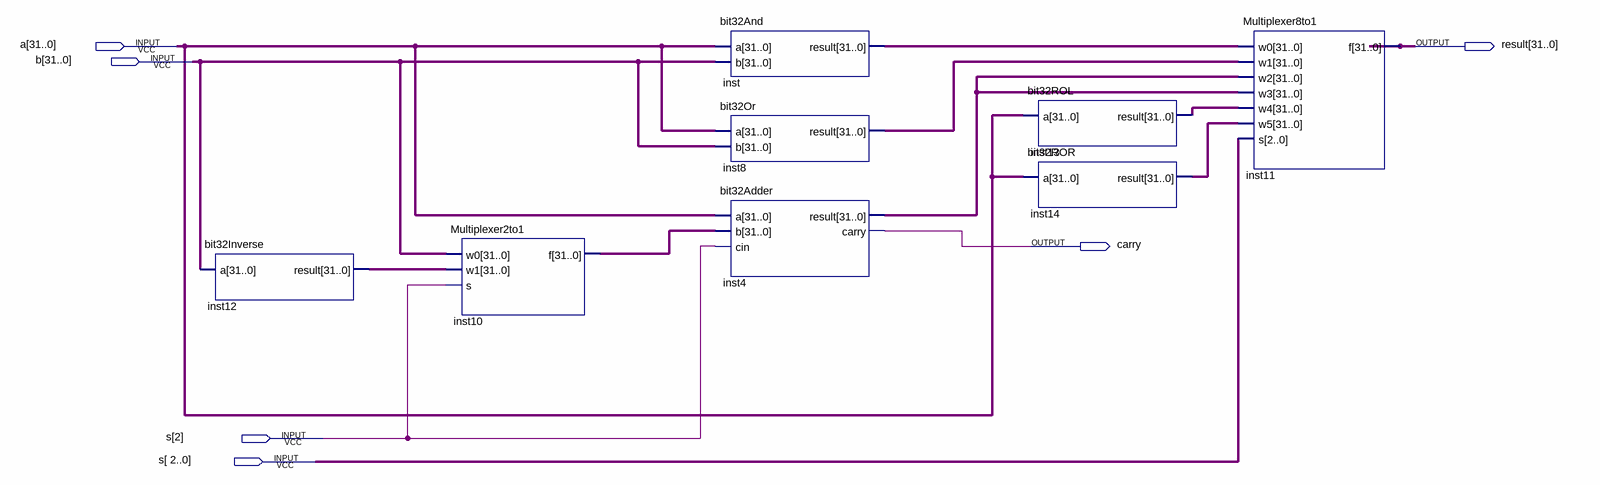
[diagram p0: schematic sheet]
// Quartus schematic lab3.bdf as structural Verilog: 8 symbols, 6 pins
module lab3 (
  input  [31:0] a,
  input  [31:0] b,
  input  [2:0] s,
  output [31:0] result,
  output carry
);

  wire [31:0] inst4_result, inst8_result, inst10_f, inst12_result, inst13_result, inst14_result, inst_result;

  bit32Inverse inst12 (.a(b), .result(inst12_result));
  Multiplexer2to1 inst10 (.w0(b), .w1(inst12_result), .s(s[2]), .f(inst10_f));
  bit32And inst (.a(a), .b(b), .result(inst_result));
  bit32Or inst8 (.a(a), .b(b), .result(inst8_result));
  bit32Adder inst4 (.a(a), .b(inst10_f), .cin(s[2]), .result(inst4_result), .carry(carry));
  bit32ROL inst13 (.a(a), .result(inst13_result));
  bit32ROR inst14 (.a(a), .result(inst14_result));
  Multiplexer8to1 inst11 (
    .w0(inst_result), .w1(inst8_result), .w2(inst4_result), .w3(inst4_result), .w4(inst13_result),
    .w5(inst14_result), .s(s), .f(result));
endmodule
